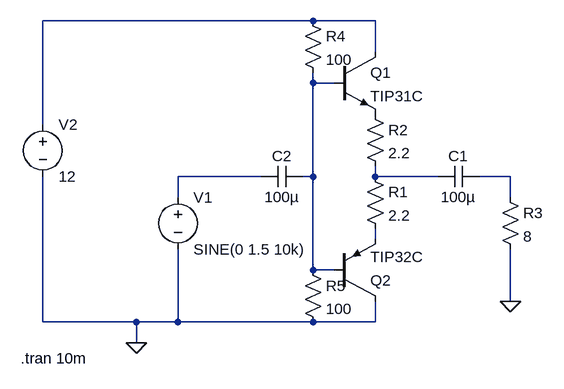
[diagram p0: schematic class b operation.asc]
class b operation.asc, the LTspice schematic file:
Version 4
SHEET 1 880 680
WIRE 288 -32 -128 -32
WIRE 384 -32 288 -32
WIRE 384 16 384 -32
WIRE 288 64 288 48
WIRE 320 64 288 64
WIRE -128 128 -128 -32
WIRE 208 208 80 208
WIRE 288 208 288 64
WIRE 288 208 272 208
WIRE 384 208 384 192
WIRE 480 208 384 208
WIRE 592 208 544 208
WIRE 80 240 80 208
WIRE 592 240 592 208
WIRE 384 304 384 288
WIRE 288 352 288 208
WIRE 320 352 288 352
WIRE 592 400 592 320
WIRE -128 432 -128 208
WIRE 16 432 -128 432
WIRE 80 432 80 320
WIRE 80 432 16 432
WIRE 288 432 80 432
WIRE 384 432 384 400
WIRE 384 432 288 432
WIRE 16 464 16 432
FLAG 16 464 0
FLAG 592 400 0
SYMBOL npn 320 16 R0
SYMATTR InstName Q1
SYMATTR Value TIP31C
SYMBOL pnp 320 400 M180
SYMATTR InstName Q2
SYMATTR Value TIP32C
SYMBOL res 368 192 R0
SYMATTR InstName R1
SYMATTR Value 2.2
SYMBOL res 368 96 R0
SYMATTR InstName R2
SYMATTR Value 2.2
SYMBOL res 576 224 R0
SYMATTR InstName R3
SYMATTR Value 8
SYMBOL cap 544 192 R90
WINDOW 0 0 32 VBottom 2
WINDOW 3 32 32 VTop 2
SYMATTR InstName C1
SYMATTR Value 100µ
SYMBOL voltage 80 224 R0
WINDOW 123 0 0 Left 0
WINDOW 39 0 0 Left 0
SYMATTR InstName V1
SYMATTR Value SINE(0 1.5 10k)
SYMBOL voltage -128 112 R0
WINDOW 123 0 0 Left 0
WINDOW 39 0 0 Left 0
SYMATTR InstName V2
SYMATTR Value 12
SYMBOL cap 272 192 R90
WINDOW 0 0 32 VBottom 2
WINDOW 3 32 32 VTop 2
SYMATTR InstName C2
SYMATTR Value 100µ
SYMBOL res 272 -48 R0
SYMATTR InstName R4
SYMATTR Value 100
SYMBOL res 272 336 R0
SYMATTR InstName R5
SYMATTR Value 100
TEXT -162 488 Left 2 !.tran 10m

The netlist it stands for:
* class b operation.asc
Q1 N001 N002 P001 0 TIP31C
Q2 0 N002 N006 0 TIP32C
R1 N004 N006 2.2
R2 P001 N004 2.2
R3 N005 0 8
C1 N005 N004 100µ
V1 N003 0 SINE(0 1.5 10k)
V2 N001 0 12
C2 N002 N003 100µ
R4 N001 N002 100
R5 N002 0 100
.model NPN NPN
.model PNP PNP
.lib standard.bjt
.tran 10m
.backanno
.end